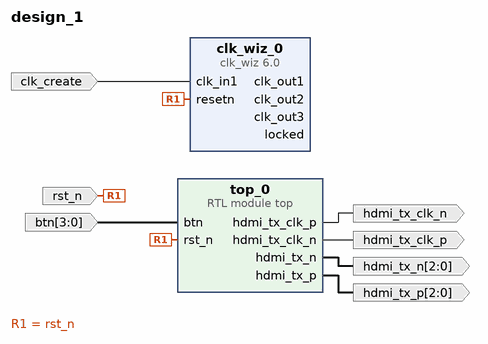
[diagram p0: block diagram of the top level]
# Vivado block design design_1, xc7z020clg400-1, Vivado 2025.2
create_bd_design design_1

create_bd_port -dir I -type clk clk_create
set_property -dict {CONFIG.FREQ_HZ 125000000} [get_bd_ports clk_create]
create_bd_port -dir I -type rst rst_n
create_bd_port -dir I -from 3 -to 0 -type data btn
create_bd_port -dir O -from 2 -to 0 -type data hdmi_tx_p
create_bd_port -dir O -from 2 -to 0 -type data hdmi_tx_n
create_bd_port -dir O -type data hdmi_tx_clk_n
create_bd_port -dir O -type data hdmi_tx_clk_p

create_bd_cell -type ip -vlnv xilinx.com:ip:clk_wiz:6.0 clk_wiz_0
set_property -dict [list \
  CONFIG.CLKIN1_JITTER_PS 80.0 \
  CONFIG.CLKOUT1_JITTER 323.721 \
  CONFIG.CLKOUT1_PHASE_ERROR 251.929 \
  CONFIG.CLKOUT1_REQUESTED_OUT_FREQ 25.178 \
  CONFIG.CLKOUT2_JITTER 231.295 \
  CONFIG.CLKOUT2_PHASE_ERROR 251.929 \
  CONFIG.CLKOUT2_REQUESTED_OUT_FREQ 125.875 \
  CONFIG.CLKOUT2_USED true \
  CONFIG.CLKOUT3_JITTER 323.721 \
  CONFIG.CLKOUT3_PHASE_ERROR 251.929 \
  CONFIG.CLKOUT3_REQUESTED_OUT_FREQ 25.000 \
  CONFIG.CLKOUT3_USED true \
  CONFIG.MMCM_CLKFBOUT_MULT_F 35.250 \
  CONFIG.MMCM_CLKIN1_PERIOD 8.000 \
  CONFIG.MMCM_CLKOUT0_DIVIDE_F 35.000 \
  CONFIG.MMCM_CLKOUT1_DIVIDE 7 \
  CONFIG.MMCM_CLKOUT2_DIVIDE 35 \
  CONFIG.MMCM_DIVCLK_DIVIDE 5 \
  CONFIG.NUM_OUT_CLKS 3 \
  CONFIG.PRIM_IN_FREQ 125.000 \
  CONFIG.RESET_PORT resetn \
  CONFIG.RESET_TYPE ACTIVE_LOW \
] [get_bd_cells clk_wiz_0]
create_bd_cell -type module -reference top top_0

# ---- connections ----

connect_bd_net [get_bd_ports rst_n] [get_bd_pins clk_wiz_0/resetn] [get_bd_pins top_0/rst_n]
connect_bd_net [get_bd_ports btn] [get_bd_pins top_0/btn]
connect_bd_net [get_bd_ports clk_create] [get_bd_pins clk_wiz_0/clk_in1]
# net clk_wiz_0_clk_out1 has one end: clk_wiz_0/clk_out1
# net clk_wiz_0_clk_out2 has one end: clk_wiz_0/clk_out2
# net clk_wiz_0_clk_out3 has one end: clk_wiz_0/clk_out3
# net clk_wiz_0_locked has one end: clk_wiz_0/locked
connect_bd_net [get_bd_pins top_0/hdmi_tx_clk_n] [get_bd_ports hdmi_tx_clk_p]
connect_bd_net [get_bd_pins top_0/hdmi_tx_clk_p] [get_bd_ports hdmi_tx_clk_n]
connect_bd_net [get_bd_pins top_0/hdmi_tx_n] [get_bd_ports hdmi_tx_n]
connect_bd_net [get_bd_pins top_0/hdmi_tx_p] [get_bd_ports hdmi_tx_p]

validate_bd_design
save_bd_design
